# Altium schematic sheet F# Sheet.SchDoc
size A1
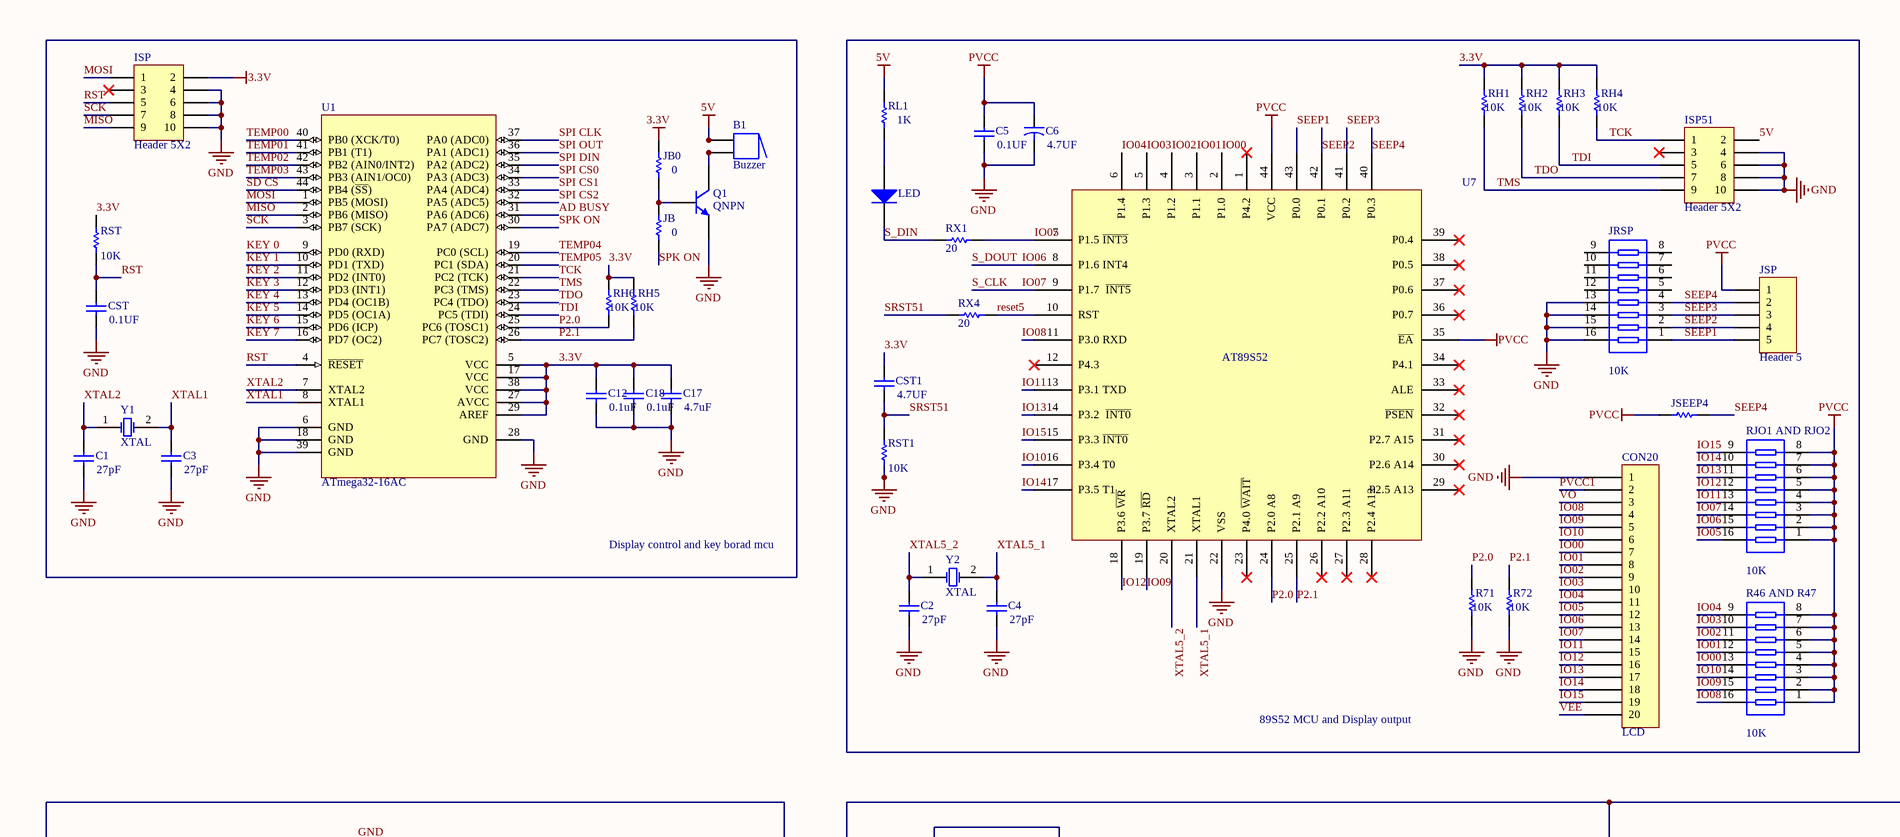
[diagram p0: F# Sheet.SchDoc, top left]
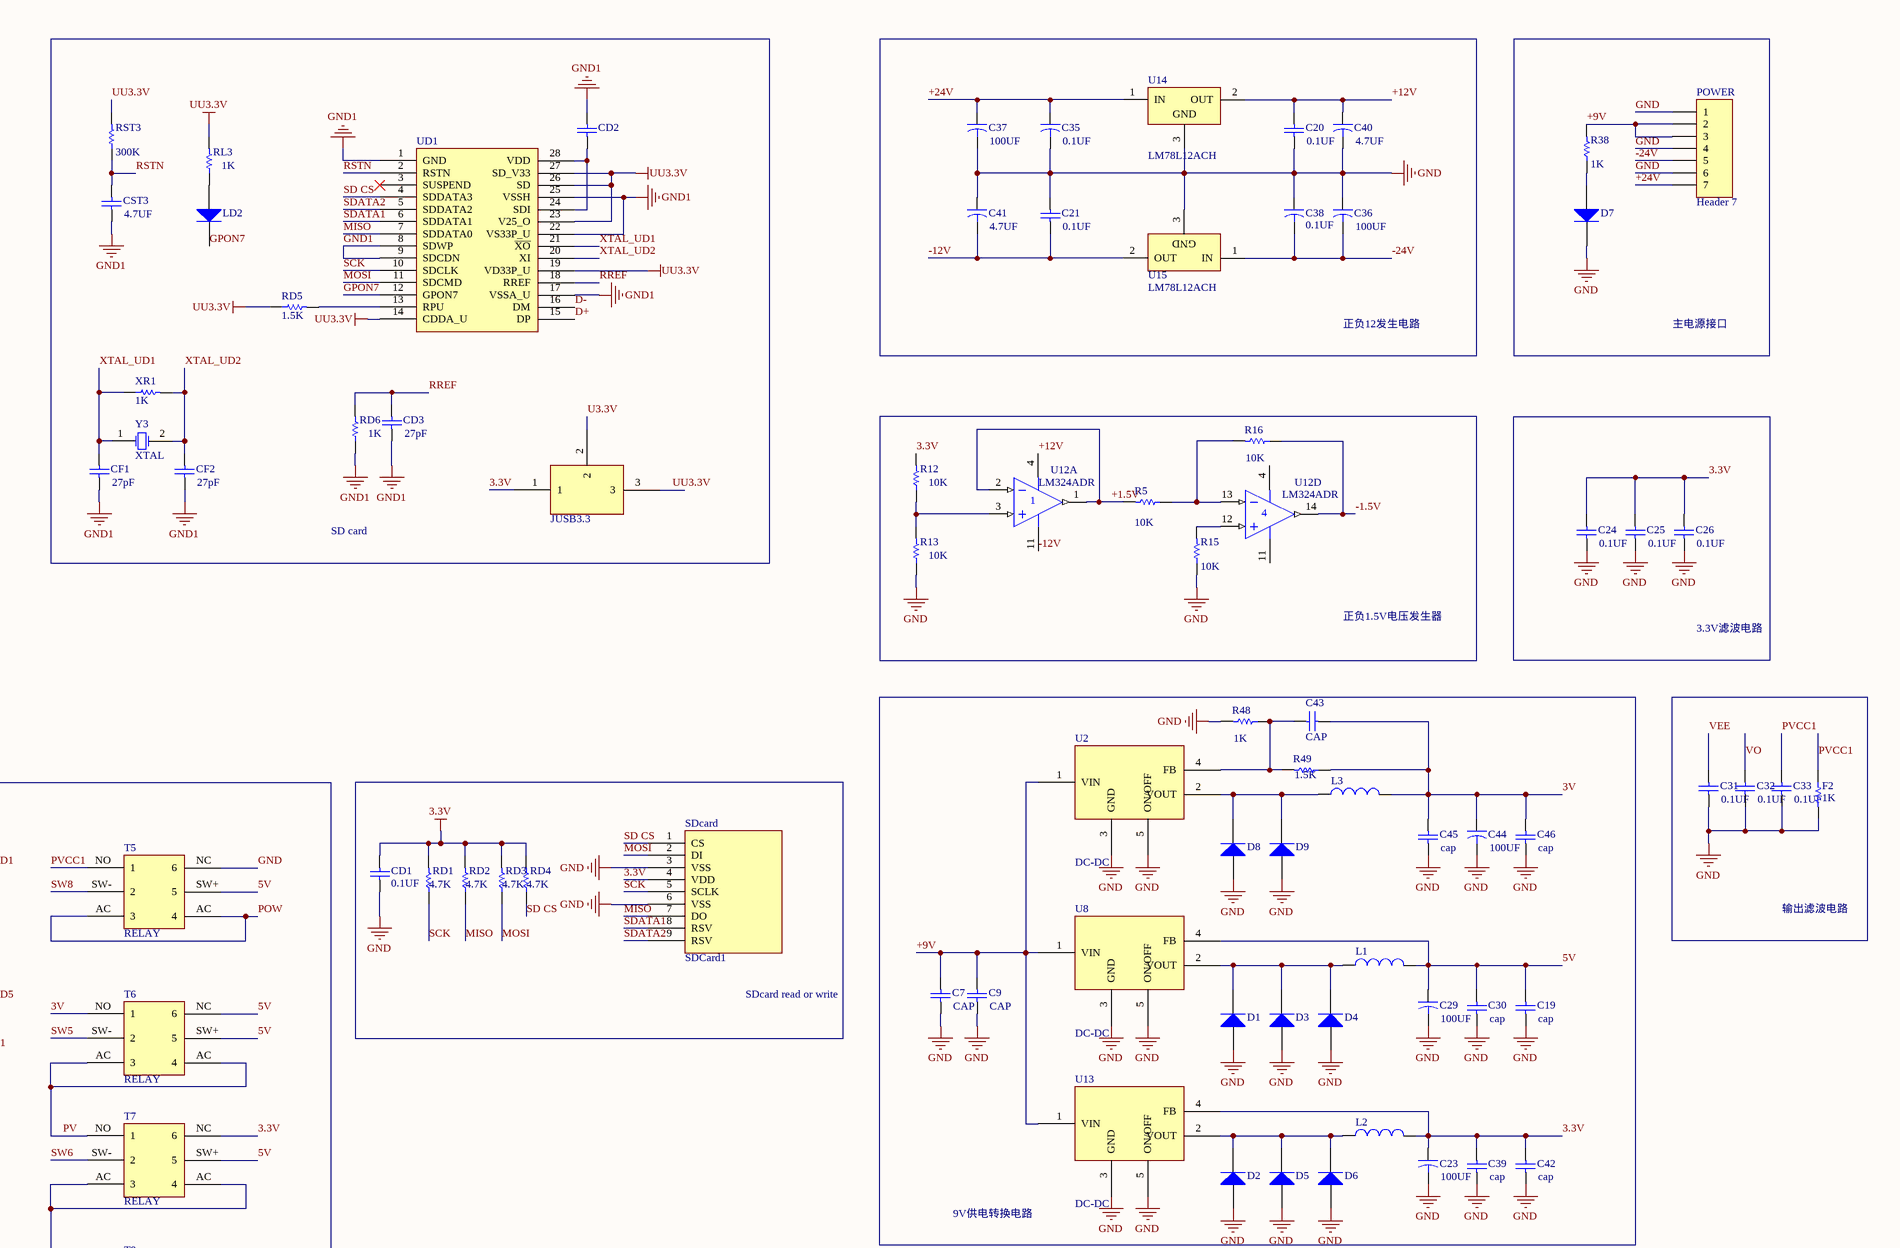
[diagram p1: F# Sheet.SchDoc, top right]
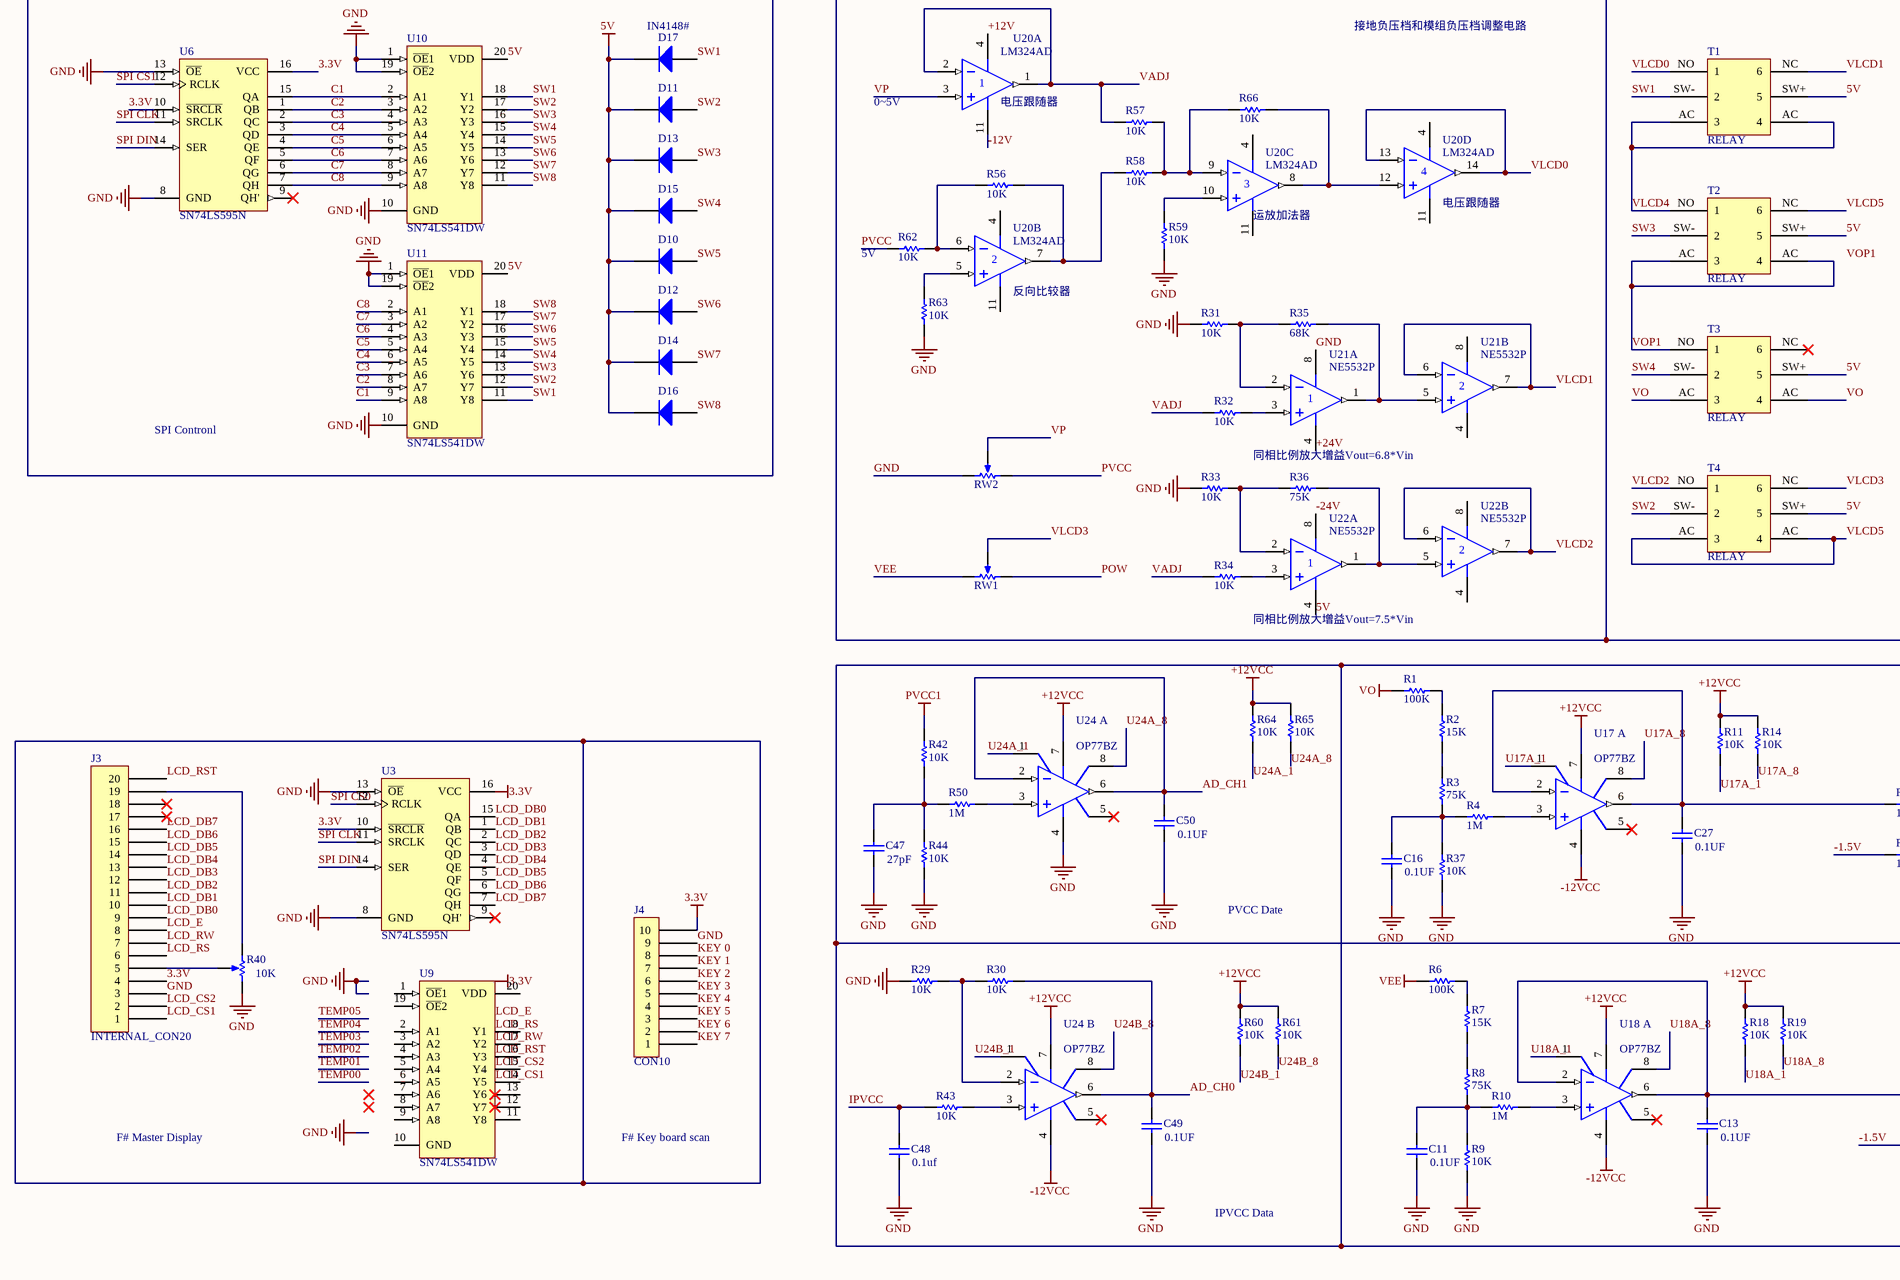
[diagram p2: F# Sheet.SchDoc, bottom left]
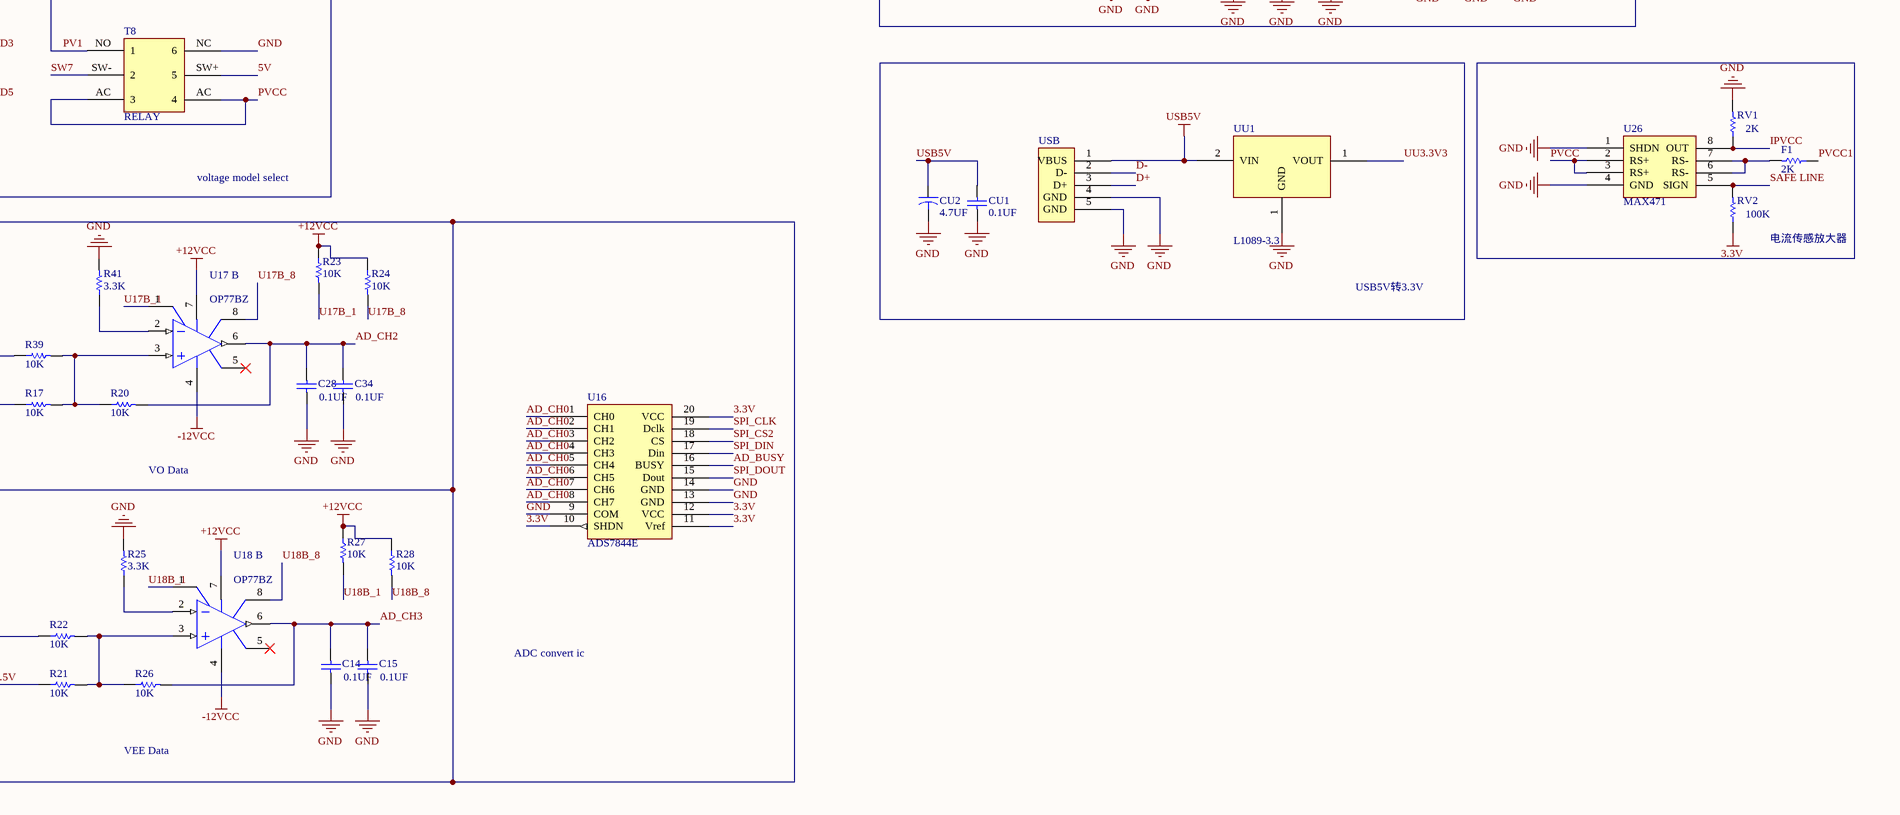
[diagram p3: F# Sheet.SchDoc, bottom right]

## Parts
?  JUSB3.3
B1  Buzzer  [ABSM-1574]
C1  value 27pF  [0402]
C2  value 27pF  [0402]
C3  value 27pF  [0402]
C4  value 27pF  [0402]
C5  value 0.1UF  [0402]
C6  value 4.7UF  [CAPR5-4X5]
C7  value CAP  [0402]
C9  value CAP  [0402]
C11  value 0.1UF  [0402]
C12  value 0.1uF  [0402]
C13  value 0.1UF  [0402]
C14  value 0.1UF  [0402]
C15  value 0.1UF  [0402]
C16  value 0.1UF  [0402]
C17  value 4.7uF  [0402]
C18  value 0.1uF  [0402]
C19  value cap  [0402]
C20  value 0.1UF  [0402]
C21  value 0.1UF  [0402]
C23  value 100UF  [CAPR5-4X5]
C24  value 0.1UF  [0402]
C25  value 0.1UF  [0402]
C26  value 0.1UF  [0402]
C27  value 0.1UF  [0402]
C28  value 0.1UF  [0402]
C29  value 100UF  [CAPR5-4X5]
C30  value cap  [0402]
C31  value 0.1UF  [0402]
C32  value 0.1UF  [0402]
C33  value 0.1UF  [0402]
C34  value 0.1UF  [0402]
C35  value 0.1UF  [CAPR5-4X5]
C36  value 100UF  [CAPR5-4X5]
C37  value 100UF  [CAPR5-4X5]
C38  value 0.1UF  [CAPR5-4X5]
C39  value cap  [0402]
C40  value 4.7UF  [CAPR5-4X5]
C41  value 4.7UF  [CAPR5-4X5]
C42  value cap  [0402]
C43  value CAP  [0402]
C44  value 100UF  [CAPR5-4X5]
C45  value cap  [0402]
C46  value cap  [0402]
C47  value 27pF  [0402]
C48  value 0.1uf  [0402]
C49  value 0.1UF  [0402]
C50  value 0.1UF  [0402]
CD1  value 0.1UF  [0402]
CD2  (no value)  [0402]
CD3  value 27pF  [0402]
CF1  value 27pF  [0402]
CF2  value 27pF  [0402]
CON20  LCD
CST  value 0.1UF  [0402]
CST1  value 4.7UF  [0402]
CST3  value 4.7UF  [0402]
CU1  value 0.1UF  [0402]
CU2  value 4.7UF  [CAPR5-4X5]
D1  (no value)  [DO-41]
D2  (no value)  [DO-41]
D3  Diode  [DO-41]  (value not drawn)
D4  Diode  [DO-41]  (value not drawn)
D5  Diode  [DO-41]  (value not drawn)
D6  Diode  [DO-41]  (value not drawn)
D7  Diode  [DO-41]  (value not drawn)
D8  Diode  [DO-41]  (value not drawn)
D9  Diode  [DO-41]  (value not drawn)
D10  Diode  [DO-41]  (value not drawn)
D11  Diode  [DO-41]  (value not drawn)
D12  (no value)  [DO-41]
D13  (no value)  [DO-41]
D14  (no value)  [DO-41]
D15  Diode  [DO-41]  (value not drawn)
D16  Diode  [DO-41]  (value not drawn)
D17  IN4148#  [DO-41]
F1  value 2K  [AXIAL-0.3]
F2  value 1K  [AXIAL-0.3]
ISP  Header 5X2  [HDR2X5]
ISP51  Header 5X2  [HDR2X5]
J3  INTERNAL_CON20
J4  CON10
JB  value 0  [AXIAL-0.3]
JB0  value 0  [AXIAL-0.3]
JRSP  value 10K  [SSOP16]  (hidden comment: Res Pack4)
JSEEP4  (no value)  [AXIAL-0.3]
JSP  Header 5  [HDR1X5]
L1  Inductor  [0402-A]  (value not drawn)
L2  Inductor  [0402-A]  (value not drawn)
L3  Inductor  [0402-A]  (value not drawn)
LD2  (no value)  [DO-41]
LED  (no value)  [DO-41]
POWER  Header 7  [HDR1X7]
Q1  QNPN  [SOT-23B]
R1  value 100K  [AXIAL-0.3]
R2  value 15K  [AXIAL-0.3]
R3  value 75K  [AXIAL-0.3]
R4  value 1M  [AXIAL-0.3]
R5  value 10K  [AXIAL-0.3]
R6  value 100K  [AXIAL-0.3]
R7  value 15K  [AXIAL-0.3]
R8  value 75K  [AXIAL-0.3]
R9  value 10K  [AXIAL-0.3]
R10  value 1M  [AXIAL-0.3]
R11  value 10K  [AXIAL-0.3]
R12  value 10K  [AXIAL-0.3]
R13  value 10K  [AXIAL-0.3]
R14  value 10K  [AXIAL-0.3]
R15  value 10K  [AXIAL-0.3]
R16  value 10K  [AXIAL-0.3]
R17  value 10K  [AXIAL-0.3]
R18  value 10K  [AXIAL-0.3]
R19  value 10K  [AXIAL-0.3]
R20  value 10K  [AXIAL-0.3]
R21  value 10K  [AXIAL-0.3]
R22  value 10K  [AXIAL-0.3]
R23  value 10K  [AXIAL-0.3]
R24  value 10K  [AXIAL-0.3]
R25  value 3.3K  [AXIAL-0.3]
R26  value 10K  [AXIAL-0.3]
R27  value 10K  [AXIAL-0.3]
R28  value 10K  [AXIAL-0.3]
R29  value 10K  [AXIAL-0.3]
R30  value 10K  [AXIAL-0.3]
R31  value 10K  [AXIAL-0.3]
R32  value 10K  [AXIAL-0.3]
R33  value 10K  [AXIAL-0.3]
R34  value 10K  [AXIAL-0.3]
R35  value 68K  [AXIAL-0.3]
R36  value 75K  [AXIAL-0.3]
R37  value 10K  [AXIAL-0.3]
R38  value 1K  [AXIAL-0.3]
R39  value 10K  [AXIAL-0.3]
R40  value 10K  [VR5]  (hidden comment: RPot)
R41  value 3.3K  [AXIAL-0.3]
R42  value 10K  [AXIAL-0.3]
R43  value 10K  [AXIAL-0.3]
R44  value 10K  [AXIAL-0.3]
R46_AND_R47  value 10K  [SSOP16]  (hidden comment: Res Pack4)
R48  value 1K  [AXIAL-0.3]
R49  value 1.5K  [AXIAL-0.3]
R50  value 1M  [AXIAL-0.3]
R56  value 10K  [AXIAL-0.3]
R57  value 10K  [AXIAL-0.3]
R58  value 10K  [AXIAL-0.3]
R59  value 10K  [AXIAL-0.3]
R60  value 10K  [AXIAL-0.3]
R61  value 10K  [AXIAL-0.3]
R62  value 10K  [AXIAL-0.3]
R63  value 10K  [AXIAL-0.3]
R64  value 10K  [AXIAL-0.3]
R65  value 10K  [AXIAL-0.3]
R66  value 10K  [AXIAL-0.3]
R71  value 10K  [AXIAL-0.3]
R72  value 10K  [AXIAL-0.3]
RD1  value 4.7K  [AXIAL-0.3]
RD2  value 4.7K  [AXIAL-0.3]
RD3  value 4.7K  [AXIAL-0.3]
RD4  value 4.7K  [AXIAL-0.3]
RD5  value 1.5K  [AXIAL-0.3]
RD6  value 1K  [AXIAL-0.3]
RH1  value 10K  [AXIAL-0.3]
RH2  value 10K  [AXIAL-0.3]
RH3  value 10K  [AXIAL-0.3]
RH4  value 10K  [AXIAL-0.3]
RH5  value 10K  [AXIAL-0.3]
RH6  value 10K  [AXIAL-0.3]
RJO1_AND_RJO2  value 10K  [SSOP16]  (hidden comment: Res Pack4)
RL1  value 1K  [AXIAL-0.3]
RL3  value 1K  [AXIAL-0.3]
RST  value 10K  [AXIAL-0.3]
RST1  value 10K  [AXIAL-0.3]
RST3  value 300K  [AXIAL-0.3]
RV1  value 2K  [AXIAL-0.3]
RV2  value 100K  [AXIAL-0.3]
RW1  RPot  [VR5]  (value not drawn)
RW2  RPot  [VR5]  (value not drawn)
RX1  value 20  [AXIAL-0.3]
RX4  value 20  [AXIAL-0.3]
SDcard  SDCard1
T1  RELAY
T2  RELAY
T3  RELAY
T4  RELAY
T5  RELAY
T6  RELAY
T7  RELAY
T8  RELAY
U1  ATmega32-16AC  [44A]
U2  DC-DC
U3  SN74LS595N  [N016]
U6  SN74LS595N  [N016]
U7  (no value)
U8  DC-DC
U9  SN74LS541DW  [751D-03]
U10  SN74LS541DW  [751D-03]
U11  SN74LS541DW  [751D-03]
U12  LM324ADR  [D014]  (parts A,D of 4)
U13  DC-DC
U14  LM78L12ACH  [H03A]
U15  LM78L12ACH  [H03A]
U16  ADS7844E
U17_A  OP77BZ  [Q-8]
U17_B  OP77BZ  [Q-8]
U18_A  OP77BZ  [Q-8]
U18_B  OP77BZ  [Q-8]
U20  LM324AD  [751A-02]  (parts A,B,C,D of 4)
U21  NE5532P  [P008]  (parts A,B of 2)
U22  NE5532P  [P008]  (parts A,B of 2)
U24_A  OP77BZ  [Q-8]
U24_B  OP77BZ  [Q-8]
U26  MAX471
UD1  UD1  (value not drawn)
USB  USB  (value not drawn)
UU1  L1089-3.3
XR1  value 1K  [AXIAL-0.3]
Y1  XTAL  [R38]
Y2  XTAL  [R38]
Y3  XTAL  [R38]

## Nets
3.3V: ?.1 C12.2 C17.2 C18.2 C23.1 C24.2 C25.2 C26.2 C39.2 C42.2 CD1.1 CST1.2 ISP.2 J3.?4(4) J4.?10(10) JB0.2 L2.2 R12.2 RD1.2 RD2.2 RD3.2 RD4.2 RH1.2 RH2.2 RH3.2 RH4.2 RH5.2 RH6.2 RST.2 RV2.1 SDcard.4(VDD) T7.NC(6) U1.5(VCC) U1.17(VCC) U1.27(AVCC) U1.29(AREF) U1.38(VCC) U3.10(~{SRCLR}) U3.16(VCC) U6.10(~{SRCLR}) U6.16(VCC) U13.4(FB) U16.10(SHDN) U16.11(Vref) U16.12(VCC) U16.20(VCC)
5V: B1.1 B1.1A C19.2 C29.1 C30.2 D10.2(K) D11.2(K) D12.2(K) D13.2(K) D14.2(K) D15.2(K) D16.2(K) D17.2(K) ISP51.2 L1.2 RL1.2 T1.SW+(5) T2.SW+(5) T3.SW+(5) T4.SW+(5) T5.SW+(5) T6.NC(6) T6.SW+(5) T7.SW+(5) T8.SW+(5) U8.4(FB) U10.20(VDD) U11.20(VDD) U22.4(V-)
+12VCC: R11.1 R14.1 R18.1 R19.1 R23.1 R24.1 R27.1 R28.1 R60.1 R61.1 R64.1 R65.1 U17_A.7(V+) U17_B.7(V+) U18_A.7(V+) U18_B.7(V+) U24_A.7(V+) U24_B.7(V+)
-12VCC: U17_A.4(V-) U17_B.4(V-) U18_A.4(V-) U18_B.4(V-) U24_B.4(V-)
GND: C1.1 C2.1 C3.1 C4.1 C5.1 C6.2 C7.1 C9.1 C11.1 C12.1 C13.1 C14.1 C15.1 C16.1 C17.1 C18.1 C19.1 C20.1 C21.2 C23.2 C24.1 C25.1 C26.1 C27.1 C28.1 C29.2 C30.1 C31.1 C32.1 C33.1 C34.1 C35.2 C36.1 C37.2 C38.1 C39.1 C40.2 C41.1 C42.1 C44.2 C45.1 C46.1 C47.1 C48.1 C49.1 C50.1 CD1.2 CON20.?1(1) CST.1 CU1.2 CU2.2 D1.1(A) D2.1(A) D3.1(A) D4.1(A) D5.1(A) D6.1(A) D7.2(K) D8.1(A) D9.1(A) F2.2 ISP.4 ISP.6 ISP.8 ISP.10 ISP51.4 ISP51.6 ISP51.8 ISP51.10 J3.?3(3) J4.?9(9) JRSP.13 JRSP.14 JRSP.15 JRSP.16 POWER.1 POWER.4 POWER.6 Q1.3(E) R9.2 R13.1 R15.1 R25.2 R29.1 R31.2 R33.2 R37.2 R40.2(BOT) R41.2 R44.2 R48.2 R59.2 R63.2 R71.1 R72.1 RST1.1 RV1.2 RW2.2(BOT) SDcard.3(VSS) SDcard.6(VSS) T5.NC(6) T8.NC(6) U1.6(GND) U1.18(GND) U1.28(GND) U1.39(GND) U2.3(GND) U2.5(ON/OFF) U3.8(GND) U3.13(~{OE}) U6.8(GND) U6.13(~{OE}) U7.22(VSS) U8.3(GND) U8.5(ON/OFF) U10.1(~{OE}1) U10.10(GND) U10.19(~{OE}2) U11.1(~{OE}1) U11.10(GND) U11.19(~{OE}2) U13.3(GND) U13.5(ON/OFF) U14.3(GND) U15.3(GND) U16.9(COM) U16.13(GND) U16.14(GND) U21.8(V+) U24_A.4(V-) U26.1(SHDN) U26.4(GND) USB.4(GND) USB.5(GND) UU1.1(GND)
GND1: CD2.1 CD3.1 CF1.1 CF2.1 CST3.1 RD6.1 UD1.1(GND) UD1.8(SDWP) UD1.9(SDCDN) UD1.17(VSSA_U) UD1.22(VS33P_U) UD1.25(VSSH)
PVCC: C5.2 C6.1 JSEEP4.2 JSP.1 R46_AND_R47.1 R46_AND_R47.2 R46_AND_R47.3 R46_AND_R47.4 R46_AND_R47.5 R46_AND_R47.6 R46_AND_R47.7 R46_AND_R47.8 R62.2 RJO1_AND_RJO2.1 RJO1_AND_RJO2.2 RJO1_AND_RJO2.3 RJO1_AND_RJO2.4 RJO1_AND_RJO2.5 RJO1_AND_RJO2.6 RJO1_AND_RJO2.7 RJO1_AND_RJO2.8 RW2.1(TOP) T8.AC(4) U7.35(~{EA}) U7.44(VCC) U26.2(RS+) U26.3(RS+)
PVCC1: C33.2 CON20.?2(2) F1.1 F2.1 R42.1 T5.NO(1)
USB5V: CU1.1 CU2.1 USB.1(VBUS) UU1.2(VIN)
UU3.3V: ?.3 RD5.1 RL3.2 RST3.2 UD1.14(CDDA_U) UD1.19(VD33P_U) UD1.23(V25_O) UD1.26(SD) UD1.27(SD_V33)
VEE: C31.2 CON20.?20(20) R6.1 RW1.2(BOT)
VO: C32.2 CON20.?3(3) R1.1 T3.AC(4)
3V: C43.1 C44.1 C45.2 C46.2 L3.2 R49.1 T6.NO(1)
+1.5V: R5.2 U12.1(OUT) U12.2(IN-)
+9V: C7.2 C9.2 POWER.2 POWER.3 R38.2 U2.1(VIN) U8.1(VIN) U13.1(VIN)
+12V: C20.2 C40.1 U12.4(V+) U14.2(OUT) U20.4(V+)
+24V: C35.1 C37.1 POWER.7 U14.1(IN) U21.4(V-)
-1.5V: R16.1 R17.1 R21.1 U12.14(OUT)
-12V: C21.1 C41.2 U12.11(V-) U15.2(OUT) U20.11(V-)
-24V: C36.2 C38.2 POWER.5 U15.1(IN) U22.8(V+)
AD BUSY: U1.31(PA6_(ADC6))
AD_BUSY: U16.16(BUSY)
AD_CH0: C49.2 R30.2 U16.1(CH0) U16.2(CH1) U16.3(CH2) U16.4(CH3) U16.5(CH4) U16.6(CH5) U16.7(CH6) U16.8(CH7) U24_B.6(OUT)
AD_CH1: C50.2 U24_A.2(IN-) U24_A.6(OUT)
AD_CH2: C28.2 C34.2 R20.2 U17_B.6(OUT)
AD_CH3: C14.2 C15.2 R26.2 U18_B.6(OUT)
C1: U6.15(QA) U10.2(A1) U11.9(A8)
C2: U6.1(QB) U10.3(A2) U11.8(A7)
C3: U6.2(QC) U10.4(A3) U11.7(A6)
C4: U6.3(QD) U10.5(A4) U11.6(A5)
C5: U6.4(QE) U10.6(A5) U11.5(A4)
C6: U6.5(QF) U10.7(A6) U11.4(A3)
C7: U6.6(QG) U10.8(A7) U11.3(A2)
C8: U6.7(QH) U10.9(A8) U11.2(A1)
D+: UD1.15(DP) USB.3(D+)
D-: UD1.16(DM) USB.2(D-)
GPON7: LD2.2(K) UD1.12(GPON7)
IO00: CON20.?7(7) R46_AND_R47.13 U7.2(P1.0)
IO01: CON20.?8(8) R46_AND_R47.12 U7.3(P1.1)
IO02: CON20.?9(9) R46_AND_R47.11 U7.4(P1.2)
IO03: CON20.?10(10) R46_AND_R47.10 U7.5(P1.3)
IO04: CON20.?11(11) R46_AND_R47.9 U7.6(P1.4)
IO05: CON20.?12(12) RJO1_AND_RJO2.16 RX1.1 U7.7(P1.5_~{INT3})
IO06: CON20.?13(13) RJO1_AND_RJO2.15 U7.8(P1.6_INT4)  [also labelled S_DOUT]
IO07: CON20.?14(14) RJO1_AND_RJO2.14 U7.9(P1.7__~{INT5})  [also labelled S_CLK]
IO08: CON20.?4(4) R46_AND_R47.16 U7.11(P3.0_RXD)
IO09: CON20.?5(5) R46_AND_R47.15 U7.19(P3.7_~{RD})
IO10: CON20.?6(6) R46_AND_R47.14 U7.16(P3.4_T0)
IO11: CON20.?15(15) RJO1_AND_RJO2.13 U7.13(P3.1_TXD)
IO12: CON20.?16(16) RJO1_AND_RJO2.12 U7.18(P3.6_~{WR})
IO13: CON20.?17(17) RJO1_AND_RJO2.11 U7.14(P3.2__~{INT0})
IO14: CON20.?18(18) RJO1_AND_RJO2.10 U7.17(P3.5_T1)
IO15: CON20.?19(19) RJO1_AND_RJO2.9 U7.15(P3.3_~{INT0})
IPVCC: C48.2 R43.1 RV1.1 U26.8(OUT)
KEY 0: J4.?8(8) U1.9(PD0_(RXD))
KEY 1: J4.?7(7) U1.10(PD1_(TXD))
KEY 2: J4.?6(6) U1.11(PD2_(INT0))
KEY 3: J4.?5(5) U1.12(PD3_(INT1))
KEY 4: J4.?4(4) U1.13(PD4_(OC1B))
KEY 5: J4.?3(3) U1.14(PD5_(OC1A))
KEY 6: J4.?2(2) U1.15(PD6_(ICP))
KEY 7: J4.?1(1) U1.16(PD7_(OC2))
LCD_CS1: J3.?1(1)
LCD_CS2: J3.?2(2)
LCD_DB0: J3.?9(9) U3.15(QA)
LCD_DB1: J3.?10(10) U3.1(QB)
LCD_DB2: J3.?11(11) U3.2(QC)
LCD_DB3: J3.?12(12) U3.3(QD)
LCD_DB4: J3.?13(13) U3.4(QE)
LCD_DB5: J3.?14(14) U3.5(QF)
LCD_DB6: J3.?15(15) U3.6(QG)
LCD_DB7: J3.?16(16) U3.7(QH)
LCD_E: J3.?8(8)
LCD_RS: J3.?6(6)
LCD_RST: J3.?20(20)
LCD_RW: J3.?7(7)
MISO: ISP.9 RD2.1 SDcard.7(DO) U1.2(PB6_(MISO)) UD1.7(SDDATA0)
MOSI: ISP.1 RD3.1 SDcard.2(DI) U1.1(PB5_(MOSI)) UD1.11(SDCMD)
P2.0: R71.2 RH6.1 U1.25(PC6_(TOSC1)) U7.24(P2.0_A8)
P2.1: R72.2 RH5.1 U1.26(PC7_(TOSC2)) U7.25(P2.1_A9)
POW: RW1.1(TOP) T5.AC(4)
PV: T6.AC(4) T7.NO(1)
PV1: T7.AC(4) T8.NO(1)
reset5: RX4.1 U7.10(RST)
RREF: CD3.2 RD6.2 UD1.18(RREF)
RST: CST.2 ISP.5 RST.1 U1.4(~{RESET})
RSTN: CST3.2 RST3.1 UD1.2(RSTN)
S_DIN: LED.2(K) RX1.2
SAFE LINE: RV2.2 U26.5(SIGN)
SCK: ISP.7 RD1.1 SDcard.5(SCLK) U1.3(PB7_(SCK)) UD1.10(SDCLK)
SD CS: RD4.1 SDcard.1(CS) U1.44(PB4_(~{SS})) UD1.4(SDDATA3)
SDATA1: SDcard.8(RSV) UD1.6(SDDATA1)
SDATA2: SDcard.9(RSV) UD1.5(SDDATA2)
SEEP1: JRSP.1 JSP.5 U7.43(P0.0)
SEEP2: JRSP.2 JSP.4 U7.42(P0.1)
SEEP3: JRSP.3 JSP.3 U7.41(P0.2)
SEEP4: JRSP.4 JSEEP4.1 JSP.2 U7.40(P0.3)
SPI CLK: U1.37(PA0_(ADC0)) U3.11(SRCLK) U6.11(SRCLK)
SPI CS0: U1.34(PA3_(ADC3)) U3.12(RCLK)
SPI CS1: U1.33(PA4_(ADC4)) U6.12(RCLK)
SPI CS2: U1.32(PA5_(ADC5))
SPI DIN: U1.35(PA2_(ADC2)) U3.14(SER) U6.14(SER)
SPI OUT: U1.36(PA1_(ADC1))
SPI_CLK: U16.19(Dclk)
SPI_CS2: U16.18(CS)
SPI_DIN: U16.17(Din)
SPI_DOUT: U16.15(Dout)
SPK ON: JB.1 U1.30(PA7_(ADC7))
SRST51: CST1.1 RST1.2 RX4.2
SW1: D17.1(A) T1.SW-(2) U10.18(Y1) U11.11(Y8)
SW2: D11.1(A) T4.SW-(2) U10.17(Y2) U11.12(Y7)
SW3: D13.1(A) T2.SW-(2) U10.16(Y3) U11.13(Y6)
SW4: D15.1(A) T3.SW-(2) U10.15(Y4) U11.14(Y5)
SW5: D10.1(A) T6.SW-(2) U10.14(Y5) U11.15(Y4)
SW6: D12.1(A) T7.SW-(2) U10.13(Y6) U11.16(Y3)
SW7: D14.1(A) T8.SW-(2) U10.12(Y7) U11.17(Y2)
SW8: D16.1(A) T5.SW-(2) U10.11(Y8) U11.18(Y1)
TCK: ISP51.1 RH4.1 U1.21(PC2_(TCK))
TDI: ISP51.5 RH3.1 U1.24(PC5_(TDI))
TDO: ISP51.7 RH2.1 U1.23(PC4_(TDO))
TEMP00: U1.40(PB0_(XCK/T0))
TEMP01: U1.41(PB1_(T1))
TEMP02: U1.42(PB2_(AIN0/INT2))
TEMP03: U1.43(PB3_(AIN1/OC0))
TEMP04: U1.19(PC0_(SCL))
TEMP05: U1.20(PC1_(SDA))
TMS: ISP51.9 RH1.1 U1.22(PC3_(TMS))
U3.3V: ?.2
U17A_1: R11.2 U17_A.1(VOSTRIM)
U17A_8: R14.2 U17_A.8(VOSTRIM)
U17B_1: R23.2 U17_B.1(VOSTRIM)
U17B_8: R24.2 U17_B.8(VOSTRIM)
U18A_1: R18.2 U18_A.1(VOSTRIM)
U18A_8: R19.2 U18_A.8(VOSTRIM)
U18B_1: R27.2 U18_B.1(VOSTRIM)
U18B_8: R28.2 U18_B.8(VOSTRIM)
U24A_1: R64.2 U24_A.1(VOSTRIM)
U24A_8: R65.2 U24_A.8(VOSTRIM)
U24B_1: R60.2 U24_B.1(VOSTRIM)
U24B_8: R61.2 U24_B.8(VOSTRIM)
UU3.3V3: UU1.1(VOUT)
VADJ: R32.2 R34.2 R57.2 U20.1(OUT) U20.2(IN-)
VLCD0: T1.NO(1) U20.13(IN-) U20.14(OUT)
VLCD1: T1.NC(6) U21.6(IN-) U21.7(OUT)
VLCD2: T4.NO(1) U22.6(IN-) U22.7(OUT)
VLCD3: RW1.3(TAP) T4.NC(6)
VLCD4: T1.AC(4) T2.NO(1)
VLCD5: T2.NC(6) T4.AC(4)
VOP1: T2.AC(4) T3.NO(1)
VP: RW2.3(TAP) U20.3(IN+)
XTAL1: C3.2 U1.8(XTAL1) Y1.2(OSC2)
XTAL2: C1.2 U1.7(XTAL2) Y1.1(OSC1)
XTAL5_1: C4.2 U7.21(XTAL1) Y2.2(OSC2)
XTAL5_2: C2.2 U7.20(XTAL2) Y2.1(OSC1)
XTAL_UD1: CF1.2 UD1.21(~{XO}) XR1.1 Y3.1(OSC1)
XTAL_UD2: CF2.2 UD1.20(XI) XR1.2 Y3.2(OSC2)
NetB1_2: B1.2 B1.2A Q1.1(C)
NetC11_2: C11.2 R8.2 R9.1 R10.1
NetC13_2: C13.2 R22.1 U18_A.2(IN-) U18_A.6(OUT)
NetC16_2: C16.2 R3.2 R4.1 R37.1
NetC27_2: C27.2 R39.1 U17_A.2(IN-) U17_A.6(OUT)
NetC43_2: C43.2 R48.1 R49.2 U2.4(FB)
NetC47_2: C47.2 R42.2 R44.1 R50.1
NetCD2_2: CD2.2 UD1.24(SDI) UD1.28(VDD)
NetD1_2: D1.2(K) D3.2(K) D4.2(K) L1.1 U8.2(VOUT)
NetD2_2: D2.2(K) D5.2(K) D6.2(K) L2.1 U13.2(VOUT)
NetD7_1: D7.1(A) R38.1
NetD8_2: D8.2(K) D9.2(K) L3.1 U2.2(VOUT)
NetF1_2: F1.2 U26.6(RS-) U26.7(RS-)
NetJ3_?5: J3.?5(5) R40.3(TAP)
NetJ3_?19: J3.?19(19) R40.1(TOP)
NetJB_2: JB.2 JB0.1 Q1.2(B)
NetLD2_1: LD2.1(A) RL3.1
NetLED_1: LED.1(A) RL1.1
NetR1_2: R1.2 R2.1
NetR2_2: R2.2 R3.1
NetR4_2: R4.2 U17_A.3(IN+)
NetR5_1: R5.1 R16.2 U12.13(IN-)
NetR6_2: R6.2 R7.1
NetR7_2: R7.2 R8.1
NetR10_2: R10.2 U18_A.3(IN+)
NetR12_1: R12.1 R13.2 U12.3(IN+)
NetR15_2: R15.2 U12.12(IN+)
NetR17_2: R17.2 R20.1 R39.2 U17_B.3(IN+)
NetR21_2: R21.2 R22.2 R26.1 U18_B.3(IN+)
NetR25_1: R25.1 U18_B.2(IN-)
NetR29_2: R29.2 R30.1 U24_B.2(IN-)
NetR31_1: R31.1 R35.2 U21.2(IN-)
NetR32_1: R32.1 U21.3(IN+)
NetR33_1: R33.1 R36.2 U22.2(IN-)
NetR34_1: R34.1 U22.3(IN+)
NetR35_1: R35.1 U21.1(OUT) U21.5(IN+)
NetR36_1: R36.1 U22.1(OUT) U22.5(IN+)
NetR41_1: R41.1 U17_B.2(IN-)
NetR43_2: R43.2 U24_B.3(IN+)
NetR50_2: R50.2 U24_A.3(IN+)
NetR56_1: R56.1 R58.2 U20.7(OUT)
NetR56_2: R56.2 R62.1 U20.6(IN-)
NetR57_1: R57.1 R58.1 R66.2 U20.9(IN-)
NetR59_1: R59.1 U20.10(IN+)
NetR63_1: R63.1 U20.5(IN+)
NetR66_1: R66.1 U20.8(OUT) U20.12(IN+)
NetRD5_2: RD5.2 UD1.13(RPU)

Not connected (* = marked no-connect by the designer): ISP 3*; ISP51 3*; J3 ?17(17)* ?18(18)*; JRSP 5 6 7 8 9 10 11 12; T3 NC(6)*; U3 9(QH')*; U6 9(QH')*; U7 1(P4.2)* 12(P4.3)* 23(P4.0_~{WAIT})* 26(P2.2_A10)* 27(P2.3_A11)* 28(P2.4_A12)* 29(P2.5_A13)* 30(P2.6_A14)* 31(P2.7_A15)* 32(~{PSEN})* 33(ALE)* 34(P4.1)* 36(P0.7)* 37(P0.6)* 38(P0.5)* 39(P0.4)*; U9 1(~{OE}1) 2(A1) 3(A2) 4(A3) 5(A4) 6(A5) 7(A6) 8(A7) 9(A8) 10(GND) 11(Y8) 12(Y7) 13(Y6) 14(Y5) 15(Y4) 16(Y3) 17(Y2) 18(Y1) 19(~{OE}2) 20(VDD); U17_A 5(NC)*; U17_B 5(NC)*; U18_A 5(NC)*; U18_B 5(NC)*; U24_A 5(NC)*; U24_B 5(NC)*; UD1 3(SUSPEND)*

## Notes on the sheet
- 正负12发生电路
- 主电源接口
- Display control and key borad mcu
- SD card
- 正负1.5V电压发生器
- 3.3V滤波电路
- 89S52 MCU and Display output
- 接地负压档和模组负压档调整电路
- 0~5V
- (near U20) 电压跟随器
- 输出滤波电路
- (near U20) 运放加法器
- SDcard read or write
- (near R62) 5V
- (near U20) 反向比较器
- SPI Contronl
- 同相比例放大增益Vout=6.8*Vin
- 9V供电转换电路
- 同相比例放大增益Vout=7.5*Vin
- voltage model select
- (near RV2) 电流传感放大器
- USB5V转3.3V
- PVCC Date
- VO Data
- F# Master Display
- F# Key board scan
- ADC convert ic
- IPVCC Data
- VEE Data
- Labels drawn without touching a wire or pin: 3.3V, LCD_CS1, LCD_CS2, LCD_E, LCD_RS, LCD_RST, LCD_RW, VOP1

## Library data of the parts
B1 = Buzzer: Magnetic Transducer Buzzer; Published: 24-Mar-1999; LatestRevisionDate: 17-Dec-2003; LatestRevisionNote: Schematic revised, PCB Footprint replaced.; DatasheetDocument: 17-Dec-2003; PackageReference: ABSM-1574; Publisher: Altium Limited; ComponentLink1Description: Manufacturer Link; ComponentLink1URL: http://www.megastar.com/linecard/buzzmode/index.php
C1-C5 C7 C9 C11-C21 C24-C28 C30-C34 C39 C42 C43 C45-C50 CD1 CD3 CF1 CF2 CST CST1 CST3 CU1 = Cap Semi: Capacitor (Semiconductor SIM Model); Published: 8-Jun-2000; LatestRevisionDate: 17-Jul-2002; LatestRevisionNote: Re-released for DXP Platform.; PackageReference: C1206; Publisher: Altium Limited
C6 C23 C29 C35-C38 C40 C41 C44 CU2 = Cap2: Capacitor; Published: 23-Sep-2002; PackageReference: CAPR5-4X5; Publisher: Altium Limited
CD2 = Cap Semi: Capacitor (Semiconductor SIM Model); Value: 4.7UF; Published: 8-Jun-2000; LatestRevisionDate: 17-Jul-2002; LatestRevisionNote: Re-released for DXP Platform.; PackageReference: C1206; Publisher: Altium Limited
CON20 = INTERNAL_CON20
D1-D17 LD2 LED = Diode 1N4001: 1 Amp General Purpose Rectifier; Published: 8-Jun-2000; LatestRevisionDate: 17-Jul-2002; LatestRevisionNote: Re-released for DXP Platform.; DatasheetDocument: 1998; PackageDocument: Aug-1999; PackageReference: DO-41; Publisher: Altium Limited; Code_JEDEC: DO-204-AL; ComponentLink1Description: Manufacturer Link; ComponentLink1URL: http://www.fairchildsemi.com/; ComponentLink2Description: Datasheet; ComponentLink2URL: http://www.fairchildsemi.com/ds/1N%2F1N4001.pdf
F1 F2 JB JB0 R1-R39 R41-R44 R48-R50 R56-R66 R71 R72 RD1-RD6 RH1-RH6 RL1 RL3 RST RST1 RST3 RV1 RV2 RX1 RX4 XR1 = Res1: Resistor; Published: 8-Jun-2000; LatestRevisionDate: 17-Jul-2002; LatestRevisionNote: Re-released for DXP Platform.; PackageReference: AXIAL-0.3; Publisher: Altium Limited
ISP ISP51 = Header 5X2: Header, 5-Pin, Dual row; LatestRevisionDate: 17-Jul-2002; LatestRevisionNote: Re-released for DXP Platform.; Publisher: Altium Limited
JRSP R46_AND_R47 RJO1_AND_RJO2 = Res Pack4: Isolated Resistor Network; Published: 24-Mar-1999; LatestRevisionDate: 17-Jul-2002; LatestRevisionNote: Re-released for DXP Platform.; PackageReference: SSOP16; Publisher: Altium Limited; Code_JEDEC: MO-150-AC
JSEEP4 = Res1: Resistor; Value: 10K; Published: 8-Jun-2000; LatestRevisionDate: 17-Jul-2002; LatestRevisionNote: Re-released for DXP Platform.; PackageReference: AXIAL-0.3; Publisher: Altium Limited
JSP = Header 5: Header, 5-Pin; LatestRevisionDate: 17-Jul-2002; LatestRevisionNote: Re-released for DXP Platform.; Publisher: Altium Limited
L1-L3 = Inductor: Code_IEC: 1005; Value: 10mH; Published: 8-Jun-2000; LatestRevisionDate: 17-Jul-2002; LatestRevisionNote: Re-released for DXP Platform.; PackageReference: 0402-A; Publisher: Altium Limited; Code_JEITA: 0402
POWER = Header 7: Header, 7-Pin; LatestRevisionDate: 17-Jul-2002; LatestRevisionNote: Re-released for DXP Platform.; Publisher: Altium Limited
Q1 = QNPN: NPN Bipolar Transistor; Published: 8-Jun-2000; LatestRevisionDate: 17-Jul-2002; LatestRevisionNote: Re-released for DXP Platform.; PackageReference: SOT-23B; Publisher: Altium Limited; Code_JEDEC: SOT-23
R40 = RPot: Potentiometer; Sim Note: Enter the Resistance value and the set point into parameter fields.; Set Position: 0.5; Published: 8-Jun-2000; LatestRevisionDate: 17-Jul-2002; LatestRevisionNote: Re-released for DXP Platform.; PackageReference: VR5; Publisher: Altium Limited
RW1 RW2 = RPot: Potentiometer; Sim Note: Enter the Resistance value and the set point into parameter fields.; Set Position: 0.5; Value: 10K; Published: 8-Jun-2000; LatestRevisionDate: 17-Jul-2002; LatestRevisionNote: Re-released for DXP Platform.; PackageReference: VR5; Publisher: Altium Limited
U1 = ATmega32-16AC: 8-Bit AVR Microcontroller with 32K Bytes of In-System Programmable Flash Memory; PackageDocument: rev.B, Oct-2001; Published: 17-Sep-2003; DatasheetDocument: 2503C-AVR-10/02; PackageReference: 44A; Publisher: Altium Limited
U3 U6 = SN74LS595N: 8-Bit Shift Register with Output Latch; Published: 8-Jun-2000; LatestRevisionDate: 17-Jul-2002; LatestRevisionNote: Re-released for DXP Platform.; DatasheetDocument: Mar-1988; PackageDocument: Oct-1995; PackageReference: N016; Publisher: Altium Limited; Code_JEDEC: MS-001-BB
U7 = AT89S52
U9-U11 = SN74LS541DW: Octal Buffer/Line Driver with 3-State Outputs; Published: 15-Apr-2002; DatasheetDocument: 18-Oct-1996; PackageReference: 751D-03; Publisher: Altium Limited
U12 = LM324ADR: Quadruple Operational Amplifier; Published: 15-Apr-2002; LatestRevisionDate: 23-Sep-2002; LatestRevisionNote: PCB footprint, 'SO-G8/E2.5' replaced.; DatasheetDocument: Jan-1989; PackageDocument: Jan-1998; PackageReference: D014; Publisher: Altium Limited
U14 U15 = LM78L12ACH: 3-Terminal Positive Regulator; PackageDocument: 2000; Note: Case is connected to GND; Published: 15-Apr-2002; DatasheetDocument: Jan-1995; PackageReference: H03A; Publisher: Altium Limited
U17_A U17_B U18_A U18_B U24_A U24_B = OP77BZ: Ultra-Low Offset Voltage Operational Amplifier; PackageDocument: 1998; Note: Pin 5 is not connected.; Published: 8-Jun-2000; LatestRevisionDate: 17-Jul-2002; LatestRevisionNote: Re-released for DXP Platform.; DatasheetDocument: 1992; PackageReference: Q-8; Publisher: Altium Limited
U20 = LM324AD: Quad Low-Power Operational Amplifier; PackageDocument: 1991; Published: 17-Jul-2002; DatasheetDocument: 1988; PackageReference: 751A-02; Publisher: Altium Limited
U21 U22 = NE5532P: Dual Low-Noise Operational Amplifier; Published: 15-Apr-2002; DatasheetDocument: May-1988; PackageDocument: Jun-1999; PackageReference: P008; Publisher: Altium Limited; Code_JEDEC: MO-001-AN
Y1-Y3 = XTAL: Crystal Oscillator; Published: 8-Jun-2000; LatestRevisionDate: 17-Jul-2002; LatestRevisionNote: Re-released for DXP Platform.; PackageReference: R38; Publisher: Altium Limited